# Altium schematic sheet RF.SchDoc: uSDR schematic
size Letter; Author: Ye-sheng Kuo; CompanyName: Univ. of Michigan; Revision: 2.0; SheetNumber: 5; SheetTotal: 16
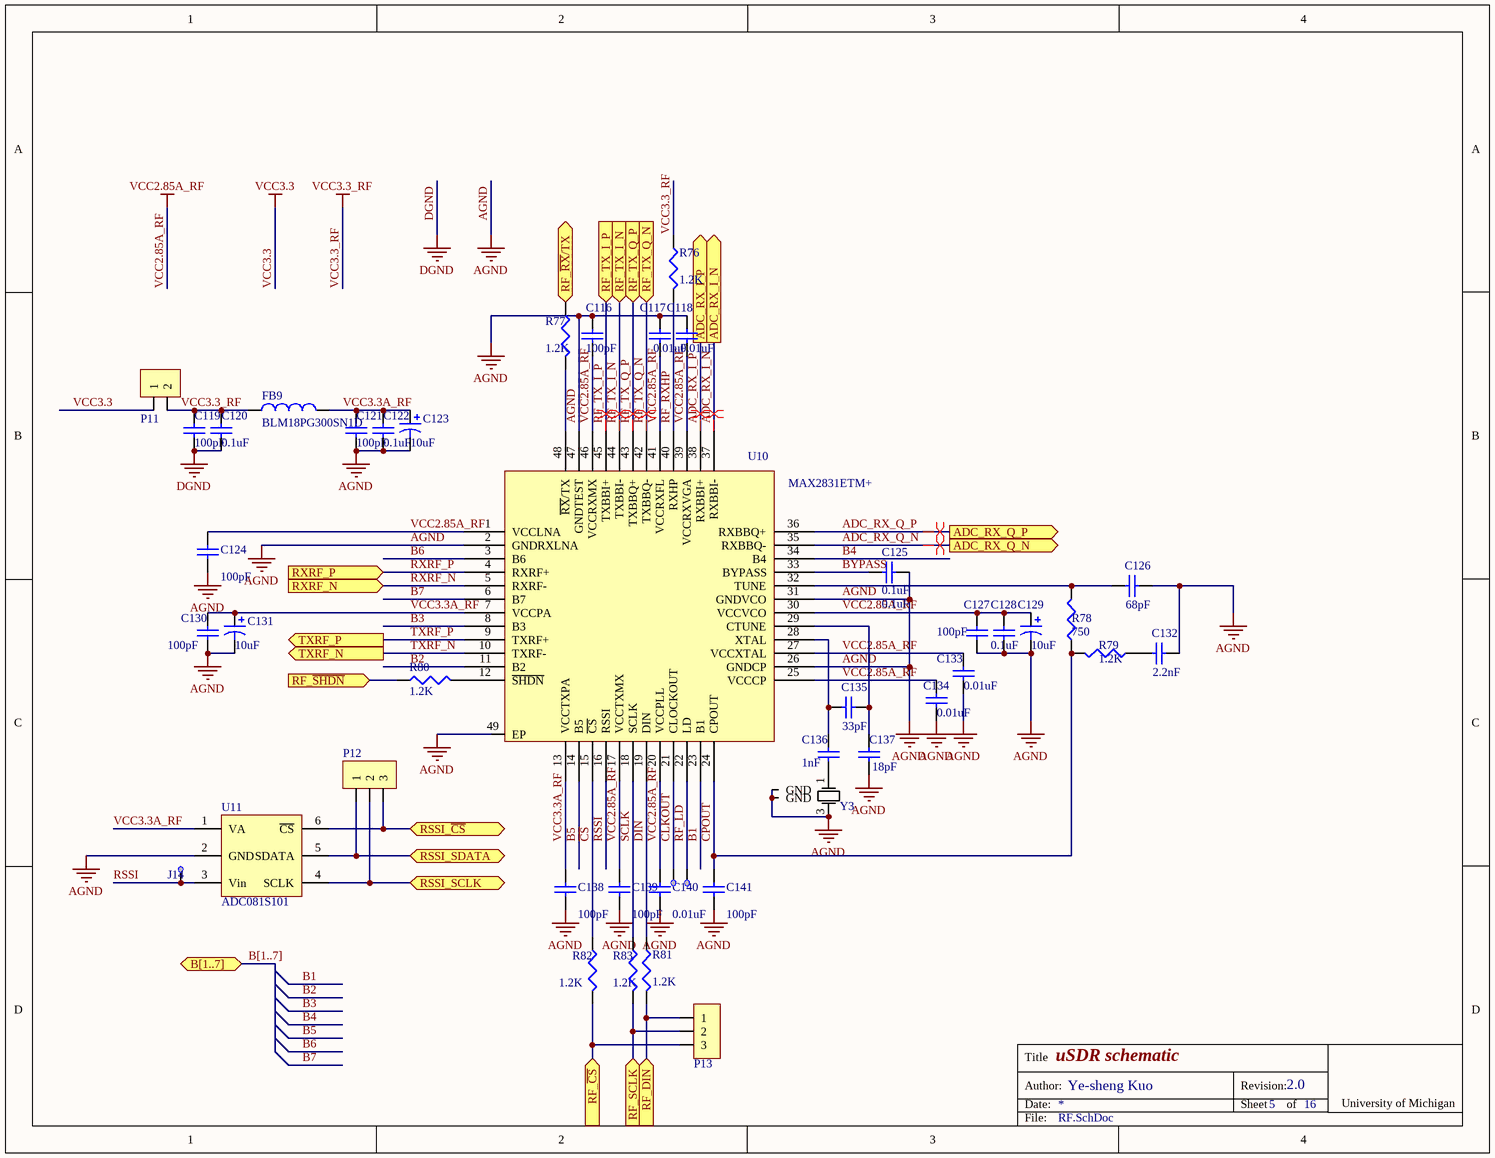
[diagram p0: RF.SchDoc]

## Parts
C116  100pF  [0402]
C117  0.01uF  [0402]
C118  0.01uF  [0402]
C119  100pF  [0402]
C120  0.1uF  [0402]
C121  100pF  [0402]
C122  0.1uF  [0402]
C123  10uF  [C0805]
C124  100pF  [0402]
C125  0.1uF  [0402]
C126  68pF  [0402]
C127  100pF  [0402]
C128  0.1uF  [0402]
C129  10uF  [C0805]
C130  100pF  [0402]
C131  10uF  [C0805]
C132  2.2nF  [0402]
C133  0.01uF  [0402]
C134  0.01uF  [0402]
C135  33pF  [0402]
C136  1nF  [0402]
C137  18pF  [0402]
C138  100pF  [0402]
C139  100pF  [0402]
C140  0.01uF  [0402]
C141  100pF  [0402]
FB9  BLM18PG300SN1D  [1608[0603]]
J14  5004  [TestPoint]  (value not drawn)
J15  5004  [TestPoint]  (value not drawn)
J16  5004  [TestPoint]  (value not drawn)
P11  1 x 2 header  [1x2 header]  (value not drawn)
P12  1 x 3 header  [1x3 header]  (value not drawn)
P13  1 x 3 header  [1x3 header]  (value not drawn)
R76  1.2K  [0402]
R77  1.2K  [0402]
R78  750  [0402]
R79  1.2K  [0402]
R80  1.2K  [0402]
R81  1.2K  [0402]
R82  1.2K  [0402]
R83  1.2K  [0402]
U10  MAX2831ETM+  [TQFN-48]
U11  ADC081S101  [SOT23-6]
Y3  CX2520SB40000H0DZF08  [CX-2520SB]  (value not drawn)

## Ports
ADC_RX_I_N (out), ADC_RX_I_P (out), ADC_RX_Q_N (out), ADC_RX_Q_P (out), B[1..7] (bidir), RF_DIN (in), RF_SCLK (in), RF_TX_I_N (in), RF_TX_I_P (in), RF_TX_Q_N (in), RF_TX_Q_P (in), RF_~{CS} (in), RF_~{RX}/TX (in), RF_~{SHDN} (in), RSSI_SCLK (bidir), RSSI_SDATA (bidir), RSSI_~{CS} (bidir), RXRF_N (in), RXRF_P (in), TXRF_N (out), TXRF_P (out)

## Nets
AGND: C116.2 C117.2 C118.2 C121.1 C122.1 C123.2 C124.1 C125.2 C126.2 C127.1 C128.1 C129.2 C130.1 C131.2 C132.2 C133.1 C134.1 C137.1 C138.1 C139.1 C140.1 C141.1 U10.2(GNDRXLNA) U10.26(GNDCP) U10.31(GNDVCO) U10.47(GNDTEST) U10.49(EP) U11.2(GND) Y3.2(GND) Y3.3(HOT) Y3.4(GND)
DGND: C119.1 C120.1
VCC2.85A_RF: C116.1 C117.1 C118.1 C124.2 C127.2 C128.2 C129.1 C133.2 C134.2 C139.2 C140.2 U10.1(VCCLNA) U10.17(VCCTXMX) U10.20(VCCPLL) U10.25(VCCCP) U10.27(VCCXTAL) U10.30(VCCVCO) U10.39(VCCRXVGA) U10.41(VCCRXFL) U10.46(VCCRXMX)
VCC3.3: P11.1
VCC3.3_RF: C119.2 C120.2 FB9.1 P11.2 R76.1
ADC_RX_I_N: U10.37(RXBBI-) ; port ADC_RX_I_N
ADC_RX_I_P: U10.38(RXBBI+) ; port ADC_RX_I_P
ADC_RX_Q_N: U10.35(RXBBQ-) ; port ADC_RX_Q_N
ADC_RX_Q_P: U10.36(RXBBQ+) ; port ADC_RX_Q_P
B1: U10.23(B1)
B2: U10.11(B2)
B3: U10.8(B3)
B4: U10.34(B4)
B5: U10.14(B5)
B6: U10.3(B6)
B7: U10.6(B7)
BYPASS: C125.1 U10.33(BYPASS)
~{CS}: R82.1 U10.15(~{CS})
CLKOUT: J15.1(TB) U10.21(CLOCKOUT)
CPOUT: C141.2 R78.1 R79.2 U10.24(CPOUT)
DIN: R81.1 U10.19(DIN)
RF_~{CS}: P13.3 R82.2 ; port RF_~{CS}
RF_DIN: P13.1 R81.2 ; port RF_DIN
RF_LD: J16.1(TB) U10.22(LD)
RF_~{RX}/TX: R77.1 ; port RF_~{RX}/TX
RF_RXHP: R76.2 U10.40(RXHP)
RF_~{SHDN}: R80.1 ; port RF_~{SHDN}
RF_SCLK: P13.2 R83.2 ; port RF_SCLK
RF_TX_I_N: U10.44(TXBBI-) ; port RF_TX_I_N
RF_TX_I_P: U10.45(TXBBI+) ; port RF_TX_I_P
RF_TX_Q_N: U10.42(TXBBQ-) ; port RF_TX_Q_N
RF_TX_Q_P: U10.43(TXBBQ+) ; port RF_TX_Q_P
RSSI: J14.1(TB) U10.16(RSSI) U11.3(Vin)
RSSI_~{CS}: P12.3 U11.6(~{CS}) ; port RSSI_~{CS}
RSSI_SCLK: P12.2 U11.4(SCLK) ; port RSSI_SCLK
RSSI_SDATA: P12.1 U11.5(SDATA) ; port RSSI_SDATA
RXRF_N: U10.5(RXRF-) ; port RXRF_N
RXRF_P: U10.4(RXRF+) ; port RXRF_P
SCLK: R83.1 U10.18(SCLK)
TXRF_N: U10.10(TXRF-) ; port TXRF_N
TXRF_P: U10.9(TXRF+) ; port TXRF_P
VCC3.3A_RF: C121.2 C122.2 C123.1 C130.2 C131.1 C138.2 FB9.2 U10.7(VCCPA) U10.13(VCCTXPA) U11.1(VA)
NetC126_1: C126.1 R78.2 U10.32(TUNE)
NetC132_1: C132.1 R79.1
NetC135_1: C135.1 C136.2 U10.28(XTAL)
NetC135_2: C135.2 C137.2 U10.29(CTUNE)
NetC136_1: C136.1 Y3.1(HOT)
NetR77_2: R77.2 U10.48(~{RX}/TX)
NetR80_2: R80.2 U10.12(~{SHDN})

## Buses and harness runs
bus B[1..7] = port B[1..7]

## Layout directives
differential pair: ADC_RX_I_N, ADC_RX_I_P, ADC_RX_Q_N, ADC_RX_Q_P, RF_TX_I_N, RF_TX_I_P, RF_TX_Q_N, RF_TX_Q_P

## Notes on the sheet
- Title
- Date:
- Author:
- Revision:
- Sheet
- of
- University of Michigan
- File:

## Library data of the parts
C116-C122 C124-C128 C130 C132-C141 = Cap Semi: Capacitor (Semiconductor SIM Model); Published: 8-Jun-2000; LatestRevisionDate: 29-May-2009; LatestRevisionNote: IPC-7351 Footprint Added.; PackageReference: C1206; Publisher: Altium Limited; PackageDescription: Chip Capacitor
  C116 C119 C121 C124 C127 C130 C138 C139 C141: Value: 100pF
  C117 C118 C133 C134 C140: Value: 0.01uF
  C120 C122 C125 C128: Value: 0.1uF
  C126: Value: 68pF
  C132: Value: 2.2nF
  C135: Value: 33pF
  C136: Value: 1nF
  C137: Value: 18pF
C123 C129 C131 = Cap Pol3: Polarized Capacitor (Surface Mount); Published: 8-Jun-2000; LatestRevisionDate: 29-May-2009; LatestRevisionNote: IPC-7351 Footprint Added.; PackageReference: C0805; Publisher: Altium Limited; PackageDescription: Chip Capacitor; Value: 10uF
FB9 = Ferrite Bead: FERRITE CHIP 30 OHM 1000MA 0603; Supplier 1: Digi-Key; Supplier Part Number 1: 490-1035-2-ND
J14-J16 = TestPoint: TEST POINT PC MINI .040"D YELLOW; Supplier 1: Digi-Key; Supplier Part Number 1: 5004K-ND; datasheet: http://mail.keyelco.com/ENG._DEPT/PDF%20CAT%20NO%20Drawings/5004.pdf
P11 = 1 x 2 header: 100 mils standard header
P12 P13 = 1 x 3 header: 100 mils standard header
R76-R83 = Res3: Resistor; Published: 8-Jun-2000; LatestRevisionDate: 29-May-2009; LatestRevisionNote: IPC-7351 Footprint Added.; PackageReference: J1-0603; Publisher: Altium Limited; PackageDescription: Chip Resistor
  R76 R77 R79-R83: Value: 1.2K
  R78: Value: 750
U10 = MAX2831: RF Transceiver 2.4-2.5GHz 802.11g/b RF Transceiver; Supplier 1: Mouser; Supplier Part Number 1: 700-MAX2831ETM+
U11 = ADC081S101: IC ADC 8BIT 1MSPS SOT23-6
Y3 = CX-2520SB: CRYSTAL 40.000MHZ 12PF SMD; Value: 40MHz; Supplier 1: Digi-Key; Supplier Part Number 1: 478-4818-1-ND; datasheet: http://global.kyocera.com/prdct/electro/pdf/xtal/cx2520db_cs_e.pdf